# EAGLE design MAX7400 Test Board (EAGLE 9.6.2)
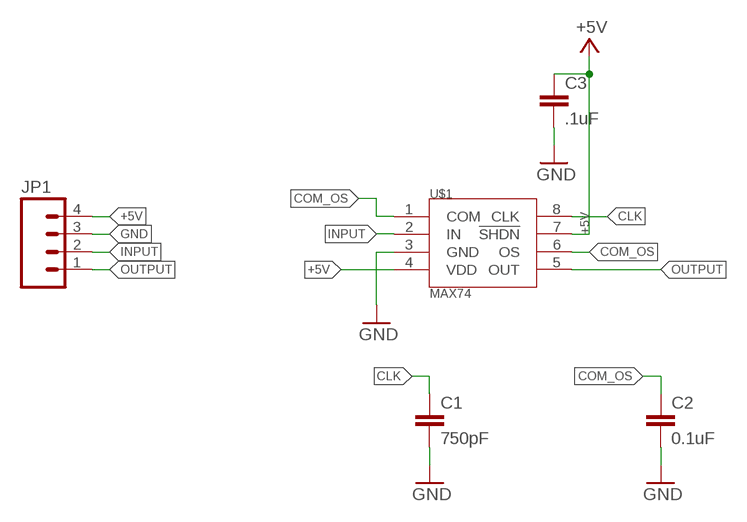
[diagram p0: schematic, sheet 1]

## Parts
C1  750pF  CAP0603-CAP  [0603-CAP]
C2  0.1uF  CAP0603-CAP  [0603-CAP]
C3  .1uF  CAP0603-CAP  [0603-CAP]
JP1  M04  [1X04]
U$1  MAX74  MAX7400  [SOP8]

## Nets
+5V: C3.1 JP1.4 U$1.4(VDD) U$1.7(!SHDN)
CLK: C1.1 U$1.8(CLK)
COM_OS: C2.1 U$1.1(COM) U$1.6(OS)
GND: C1.2 C2.2 C3.2 JP1.3 U$1.3(GND)
INPUT: JP1.2 U$1.2(IN)
OUTPUT: JP1.1 U$1.5(OUT)

## Library data of the parts
C1-C3 = HyTechDevices:CAP: Capacitor Standard 0603 ceramic capacitor, and 0.1" leaded capacitor.
JP1 = HyTechDevices:M04: Standard 4-pin 0.1" header. NOTES ON THE VARIANTS LOCK and LOCK_LONGPADS... This footprint was designed to help hold the alignment of a through-hole component (i.e. 6-pin header) while soldering it into place. You may notice that each hole has been shifted either up or down by 0.005 of an inch from it's more standard position (which is a perfectly straight line). This slight alteration caused the pins (the squares in the middle) to touch the edges of the holes. Because they are alternating, it causes a "brace" to hold the component in place. 0.005 has proven to be the perfect amount of "off-center" position when using our standard breakaway headers. Although looks a little odd when you look at the bare footprint, once you have a header in there, the alteration is very hard to notice. Also,if you push a header all the way into place, it is covered up entirely on the bottom side. This idea of altering the position of holes to aid alignment will be further integrated into the Sparkfun Library for other footprints. It can help hold any component with 3 or more connection pins. Note: The Sparkfun version includes many other packages including surface mount that may be of future interest. Source: Sparkfun <https://github.com/sparkfun/SparkFun-Eagle-Libraries>
U$1 = HyTechDevices:MAX7400: MAX7400 Elliptic Filter Datasheet <https://datasheets.maximintegrated.com/en/ds/MAX7400-MAX7407.pdf>

## Board
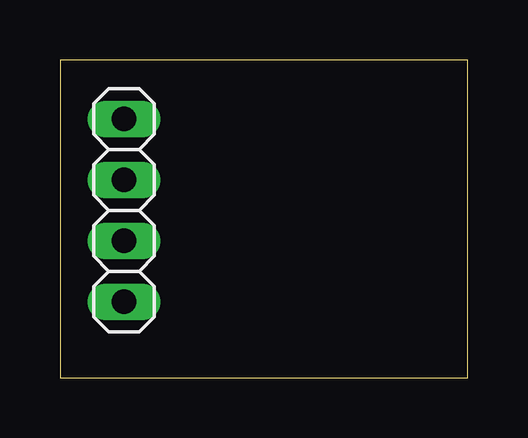
[diagram p1: board, top side]
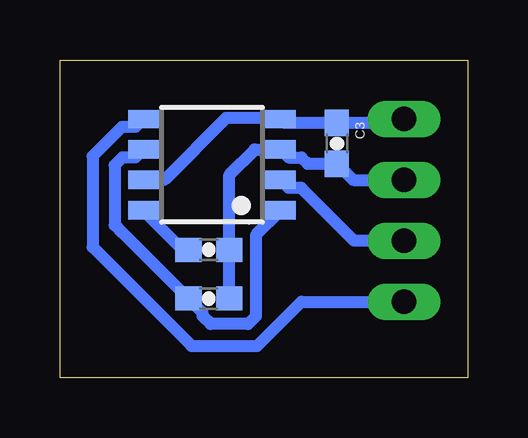
[diagram p2: board, bottom side, seen from below]

Size 17 x 13.26 mm. Coordinates in mm from the lower left corner, seen from the top.
Outline: 0,0 17,0 17,13.26 0,13.26 0,0
Copper layers (1*16): Top 0.035mm / dielectric 1.53mm / Bottom 0.035mm
Design rules "JLCPCB (2 Layer)": minimum track width 5mil, minimum drill 0.3mm, track to track 5mil, track to pad 5mil, pad to pad 5mil, via to via 20mil, smd to smd 5mil, copper to edge 0.2mm, drill to drill 21mil, minimum pad ring 6mil, minimum via ring 6mil, stop-mask expansion 2mil, vias tented up to drill 30mil, thermal gap 10mil

### Footprints (pad centres in the part's own frame; a part is rotated, then mirrored left to right if it is on the bottom)
0603-CAP = smd 1.1 x 1: 1 -0.85,0; 2 0.85,0
1X04 = drill 1.016 long: 1 -3.81,0; 2 -1.27,0; 3 1.27,0; 4 3.81,0
SOP8 = smd 0.76 x 1.27: 1 -1.905,-2.86; 2 -0.635,-2.86; 3 0.635,-2.86; 4 1.905,-2.86; 5 1.905,2.86; 6 0.635,2.86; 7 -0.635,2.86; 8 -1.905,2.86

### Placement (x,y rotation side)
C1  10.79,5.33 0 bottom
C2  10.79,3.3 0 bottom
C3  5.46,9.78 270 bottom
JP1  2.67,6.98 90 top
U$1  10.67,8.89 90 bottom

### Tracks (layer width: path | path; a pad name or v marks a point on that pad's centre or on a via)
+5V
  Bottom 0.508: U$1.7 12.66,8.25 10.07,10.84 7.86,10.84 U$1.4 7.64,10.63 C3.1 2.83,10.63 JP1.4
CLK
  Bottom 0.508: U$1.8 11.88,5.33 C1.1
COM_OS
  Bottom 0.508: U$1.6 13.86,9.19 14.39,9.19 14.72,8.87 14.72,6.37 14.39,6.05 C2.1 11.05,2.71 11.05,2.57 10.73,2.24 9.16,2.24 8.84,2.57 8.84,5.96 U$1.1
GND
  Bottom 0.508: JP1.3 4.79,8.25 C3.2 6.68,8.93 6.94,9.19 7.48,9.19 U$1.3 8.89,9.53 9.95,8.47 C1.2 C2.2
INPUT
  Bottom 0.508: U$1.2 7.48,7.92 6.94,7.92 4.73,5.71 JP1.2
OUTPUT
  Bottom 0.508: U$1.5 13.86,10.46 14.42,10.46 15.64,9.24 15.64,5.45 11.51,1.33 8.79,1.33 6.94,3.17 JP1.1